# Altium schematic sheet Micro.SchDoc
size 228 x 215 mm; SheetNumber: 2; SheetTotal: 6
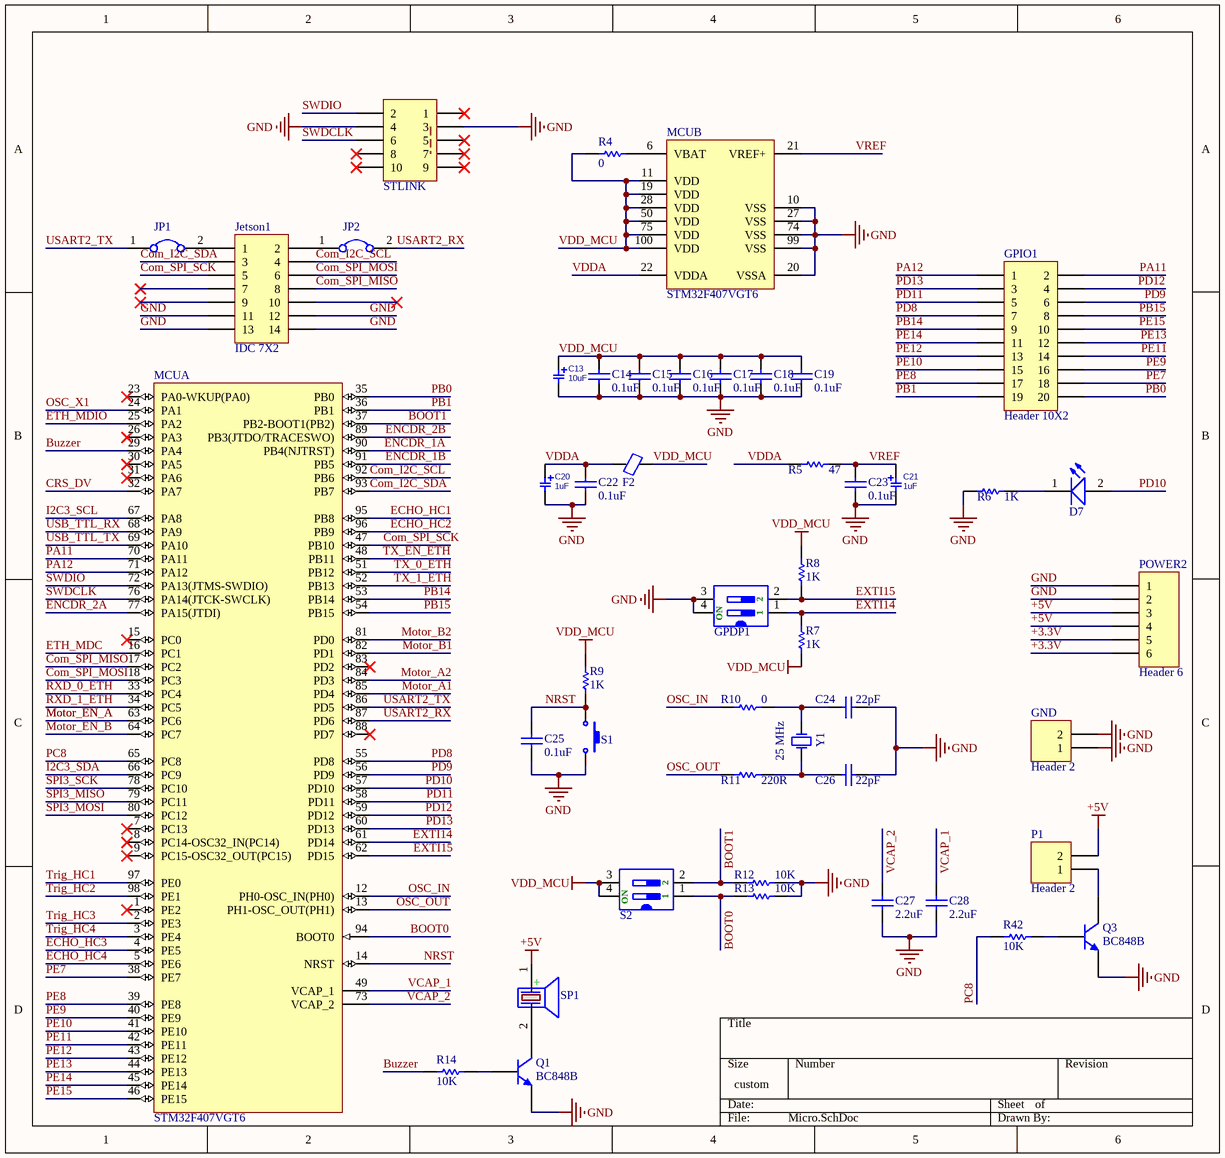
[diagram p0: Micro.SchDoc]

## Parts
C13  10uF  [C_TN_6032]
C14  0.1uF  [CAPC3413X12N]
C15  0.1uF  [CAPC3413X12N]
C16  0.1uF  [CAPC3413X12N]
C17  0.1uF  [CAPC3413X12N]
C18  0.1uF  [CAPC3413X12N]
C19  0.1uF  [CAPC3413X12N]
C20  1uF  [C_TN_6032]
C21  1uF  [C_TN_6032]
C22  0.1uF  [CAPC3413X12N]
C23  0.1uF  [CAPC3413X12N]
C24  22pF  [CAPC3413X12N]
C25  0.1uF  [CAPC3413X12N]
C26  22pF  [CAPC3413X12N]
C27  2.2uF  [CAPC3413X12N]
C28  2.2uF  [CAPC3413X12N]
D7  LED SMD PACKAGE  [LED_SMD_0805]  (value not drawn)
F2  Ferrite Bead SMD  [FB0805]  (value not drawn)
GND  Header 2  [HDR1X2]
GPDP1  SW_DIP_02  [SMV_DIP_CTS-219-02]  (value not drawn)
GPIO1  Header 10X2  [HDR2X10]
Jetson1  IDC 7X2  [IDC 7X2]
JP1  Jumper  [Jumper Small - 2.54 - GRAY]  (value not drawn)
JP2  Jumper  [Jumper Small - 2.54 - GRAY]  (value not drawn)
MCU  STM32F407VGT6  [STM-LQFP100_N]  (parts A,B of 2)
P1  Header 2  [HDR1X2]
POWER2  Header 6  [HDR1X6]
Q1  BC848B  [SOT23_L]
Q3  BC848B  [SOT23_L]
R4  0  [RESC3413X04N]
R5  47  [RESC3413X04N]
R6  1K  [RESC3413X04N]
R7  1K  [RESC3413X04N]
R8  1K  [RESC3413X04N]
R9  1K  [RESC3413X04N]
R10  0  [RESC3413X04N]
R11  220R  [RESC3413X04N]
R12  10K  [RESC3413X04N]
R13  10K  [RESC3413X04N]
R14  10K  [RES0805_(2012X06L)]
R42  10K  [RES0805_(2012X06L)]
S1  Switch PB  [SW-PB]  (value not drawn)
S2  SW_DIP_02  [SMV_DIP_CTS-219-02]  (value not drawn)
SP1  (no value)  [BUZZER 7.62mm DC]
STLINK  CONNECTOR_IDC_5X2  [IDC2.54-10PIN]  (value not drawn)
Y1  25 MHz  [Crystal SMD]

## Nets
+5V: P1.2 POWER2.3 POWER2.4 SP1.1(+)
GND: C13.2 C14.1 C15.1 C16.1 C17.1 C18.1 C19.1 C20.2 C21.2 C22.1 C23.1 C24.1 C25.1 C26.1 C27.1 C28.1 GND.1 GND.2 GPDP1.3 GPDP1.4 Jetson1.11 Jetson1.12 Jetson1.13 Jetson1.14 MCU.10(VSS) MCU.20(VSSA) MCU.27(VSS) MCU.74(VSS) MCU.99(VSS) POWER2.1 POWER2.2 Q1.2(E) Q3.2(E) R6.1 R12.2 R13.2 S1.2 STLINK.3 STLINK.4
VDD_MCU: C13.1 C14.2 C15.2 C16.2 C17.2 C18.2 C19.2 F2.2 MCU.11(VDD) MCU.19(VDD) MCU.28(VDD) MCU.50(VDD) MCU.75(VDD) MCU.100(VDD) R4.1 R7.1 R8.1 R9.2 S2.3 S2.4
+3.3V: POWER2.5 POWER2.6
BOOT0: MCU.94(BOOT0) R13.1 S2.1
BOOT1: MCU.37(PB2-BOOT1(PB2)) R12.1 S2.2
Buzzer: MCU.29(PA4) R14.1
Com_I2C_SCL: Jetson1.4 MCU.92(PB6)
Com_I2C_SDA: Jetson1.3 MCU.93(PB7)
Com_SPI_MISO: Jetson1.8 MCU.17(PC2)
Com_SPI_MOSI: Jetson1.6 MCU.18(PC3)
Com_SPI_SCK: Jetson1.5 MCU.47(PB10)
CRS_DV: MCU.32(PA7)
ECHO_HC1: MCU.95(PB8)
ECHO_HC2: MCU.96(PB9)
ECHO_HC3: MCU.4(PE5)
ECHO_HC4: MCU.5(PE6)
ENCDR_1A: MCU.90(PB4(NJTRST))
ENCDR_1B: MCU.91(PB5)
ENCDR_2A: MCU.77(PA15(JTDI))
ENCDR_2B: MCU.89(PB3(JTDO/TRACESWO))
ETH_MDC: MCU.16(PC1)
ETH_MDIO: MCU.25(PA2)
EXTI14: GPDP1.1 MCU.61(PD14) R7.2
EXTI15: GPDP1.2 MCU.62(PD15) R8.2
I2C3_SCL: MCU.67(PA8)
I2C3_SDA: MCU.66(PC9)
Motor_A1: MCU.85(PD4)
Motor_A2: MCU.84(PD3)
Motor_B1: MCU.82(PD1)
Motor_B2: MCU.81(PD0)
Motor_EN_A: MCU.63(PC6)
Motor_EN_B: MCU.64(PC7)
NRST: C25.2 MCU.14(NRST) R9.1 S1.1
OSC_IN: MCU.12(PH0-OSC_IN(PH0)) R10.1
OSC_OUT: MCU.13(PH1-OSC_OUT(PH1)) R11.1
OSC_X1: MCU.24(PA1)
PA11: GPIO1.2 MCU.70(PA11)
PA12: GPIO1.1 MCU.71(PA12)
PB0: GPIO1.20 MCU.35(PB0)
PB1: GPIO1.19 MCU.36(PB1)
PB14: GPIO1.9 MCU.53(PB14)
PB15: GPIO1.8 MCU.54(PB15)
PC8: MCU.65(PC8) R42.1
PD8: GPIO1.7 MCU.55(PD8)
PD9: GPIO1.6 MCU.56(PD9)
PD10: D7.2(A) MCU.57(PD10)
PD11: GPIO1.5 MCU.58(PD11)
PD12: GPIO1.4 MCU.59(PD12)
PD13: GPIO1.3 MCU.60(PD13)
PE7: GPIO1.18 MCU.38(PE7)
PE8: GPIO1.17 MCU.39(PE8)
PE9: GPIO1.16 MCU.40(PE9)
PE10: GPIO1.15 MCU.41(PE10)
PE11: GPIO1.14 MCU.42(PE11)
PE12: GPIO1.13 MCU.43(PE12)
PE13: GPIO1.12 MCU.44(PE13)
PE14: GPIO1.11 MCU.45(PE14)
PE15: GPIO1.10 MCU.46(PE15)
RXD_0_ETH: MCU.33(PC4)
RXD_1_ETH: MCU.34(PC5)
SPI3_MISO: MCU.79(PC11)
SPI3_MOSI: MCU.80(PC12)
SPI3_SCK: MCU.78(PC10)
SWDCLK: MCU.76(PA14(JTCK-SWCLK)) STLINK.6
SWDIO: MCU.72(PA13(JTMS-SWDIO)) STLINK.2
Trig_HC1: MCU.97(PE0)
Trig_HC2: MCU.98(PE1)
Trig_HC3: MCU.2(PE3)
Trig_HC4: MCU.3(PE4)
TX_0_ETH: MCU.51(PB12)
TX_1_ETH: MCU.52(PB13)
TX_EN_ETH: MCU.48(PB11)
USART2_RX: JP2.2 MCU.87(PD6)
USART2_TX: JP1.1 MCU.86(PD5)
USB_TTL_RX: MCU.68(PA9)
USB_TTL_TX: MCU.69(PA10)
VCAP_1: C28.2 MCU.49(VCAP_1)
VCAP_2: C27.2 MCU.73(VCAP_2)
VDDA: C20.1 C22.2 F2.1 MCU.22(VDDA) R5.1
VREF: C21.1 C23.2 MCU.21(VREF+) R5.2
NetC24_2: C24.2 R10.2 Y1.2(OSC2)
NetC26_2: C26.2 R11.2 Y1.1(OSC1)
NetD7_1: D7.1(K) R6.2
NetJetson1_1: Jetson1.1 JP1.2
NetJetson1_2: Jetson1.2 JP2.1
NetMCU_6: MCU.6(VBAT) R4.2
NetP1_1: P1.1 Q3.3(C)
NetQ1_1: Q1.1(B) R14.2
NetQ1_3: Q1.3(C) SP1.2(-)
NetQ3_1: Q3.1(B) R42.2

Not connected (* = marked no-connect by the designer): Jetson1 7* 9* 10*; MCU 1(PE2)* 7(PC13)* 8(PC14-OSC32_IN(PC14))* 9(PC15-OSC32_OUT(PC15))* 15(PC0)* 23(PA0-WKUP(PA0))* 26(PA3)* 30(PA5)* 31(PA6)* 83(PD2)* 88(PD7)*; STLINK 1* 5* 7* 8* 9* 10*

## Notes on the sheet
- (in symbol SW_DIP_02) ON

## Library data of the parts
C13 C20 C21 = CAP_SMD_TAN: CAP, SMD, TAN,; PARAM: 25V
  C13: VALUE: 10uF
  C20 C21: VALUE: 1uF
C14-C19 C22-C28 = CAP SMD 0805: CAP 0805; Designer: Abbas Basereh; Desc.: CAP SMD 0805; Data: 16-12-2016
D7 = LED SMD PACKAGE: SMD Mono-color Chip LED Waterclear; Part Number: 150080BS75000; Peak Wavelength: 465 nm; Forward Voltage: 3.2 V; Published Date: Jan 2017; Publisher: Ali Hafizi
F2 = Ferrite Bead SMD Package: Designer: Ali Hafizi
GND P1 = Header 2: Header, 2-Pin; LatestRevisionDate: 17-Jul-2002; LatestRevisionNote: Re-released for DXP Platform.; Publisher: Altium Limited
GPIO1 = Header 10X2: Header, 10-Pin, Dual row; LatestRevisionDate: 17-Jul-2002; LatestRevisionNote: Re-released for DXP Platform.; Publisher: Altium Limited
JP1 JP2 = Jumper: Company: E.P.I.L; Defualt State: Close; Design Date: 2011/11/02
MCU = STM32F407VGT6: ARM Cortex-M4 32-bit MCU+FPU, 210 DMIPS, 1024 kB Flash, 192 kB Internal RAM, 82 I/Os, 100-pin LQFP, -40 to 85 degC, Tray; Manufacturer: STMicroelectronics; D/A Converter: 2x12-bit; FLASH Size (Prog) (kB): 1024; I/Os (High Current): 82; Internal RAM Size (kB): 192; Operating Frequency(F) (Processor speed) (MHz): 168; Supply Voltage(Vcc) max (V): 3.6; Supply Voltage(Vcc) min (V): 1.8; DatasheetVersion: Rev. 4; PackageVersion: Rev. 1, 06/2013; PackageReference: LQFP100; PackageDescription: 100-Pin Low Profile Quad Flat Package, 14 x 14 mm Body, 0.5 mm Pitch; Supplier 1: Digi-Key; Supplier Part Number 1: 497-11605-ND; Supplier 2: Farnell; Supplier Part Number 2: 2064368; Supplier 3: Newark; Supplier Part Number 3: 73T2333; Supplier 4: Mouser; Supplier Part Number 4: 511-STM32F407VGT6; Core: ARM Cortex-M4; Packing: Tray; Mounting Technology: Surface Mount; PartNumber: STM32F407VGT6; ComponentLink1Description: Manufacturer URL; ComponentLink1URL: http://www.st.com/web/en/home.html; ComponentLink2Description: Datasheet; ComponentLink2URL: http://www.st.com/st-web-ui/static/active/en/resource/technical/document/datasheet/DM00037051.pdf; ComponentLink3Description: Package Specification; ComponentLink3URL: http://www.st.com/st-web-ui/static/active/en/resource/technical/document/data_brief/DM00071938.pdf
POWER2 = Header 6: Header, 6-Pin; LatestRevisionDate: 17-Jul-2002; LatestRevisionNote: Re-released for DXP Platform.; Publisher: Altium Limited
Q1 Q3 = BC848B: NPN General-purpose Transistor; Published: 2017-1-6; LatestRevisionDate: 12-Dec-2006; LatestRevisionNote: IPC-7351 Footprint Added.; DatasheetVersion: 4-Feb-2002; PackageVersion: 2017-1-6; PackageReference: SOT23; Publisher: Abbas Basereh; PackageDescription: 3-Pin SOT-23 Package 0.95 mm Pitch, 2.3 mm Lead Span; ComponentLink1Description: Manufacturer Link; ComponentLink1URL: http://www.semiconductors.philips.com/; ComponentLink2Description: Datasheet; ComponentLink2URL: http://www.semiconductors.philips.com/acrobat/datasheets/BC846_BC847_BC848_5.pdf
R4-R13 = RES 0805 0.125W: RES 0805; Designer: Abbas Basereh; Desc.: RES SMD 0805; Data: 16-12-2016
R14 R42 = RES SMD PACKAGE: TOTAL SMD RESISTOR PACK; Designer: Abbas Basereh; Desc.: RES SMD PAKAGES; Data: 2017-3-10
S1 = Switch PB: Push Button Switch
SP1 = PIEZO BUZZER: PIEZO BUZZER ACTIVE; Designer: Abbas Basereh; Comment_1: SPEAKER AND BEEP; Design Date: 1395/11/14; ComponentLink2Description: Reference; PackageDescription: THD; Publisher: Abbas Basereh; Mounting Technology: THD; Pin Count: 2; Status: Unreleased
STLINK = IDC 5X2: IDC, 5-Pin, Dual row; Manufacturer: CHINA; designer: ABBAS BASEREH; Connector type: IDC5X2  PROGPIN; Max Current: mA; LatestRevisionDate: 1395-11-17; Publisher: ABBAS BASEREH; Mounting Technology: Through-Hole; Category: Connector; Pin Count: 10; Status: Unreleased; ComponentLink1Description: Datasheet; ComponentLink2Description: Reference; Update: 2017-2-4
Y1 = XTAL: XTAL Crystal; Designer: ABBAS BASEREH; Value: 12 MHz; Design Date: 2017-1-3; ComponentLink1Description: Datasheet; ComponentLink2Description: Reference; Mounting Technology: Surface Mount\Through-Hole; Status: Unreleased